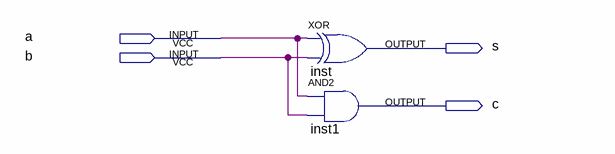
[diagram p0: schematic sheet]
// Quartus schematic t_ha.bdf as structural Verilog: 2 symbols, 4 pins
module t_ha (
  input  a,
  input  b,
  output s,
  output c
);

  xor inst (s, a, b);
  and inst1 (c, a, b);
endmodule
